# EAGLE design FET_bord (EAGLE 9.6.2)
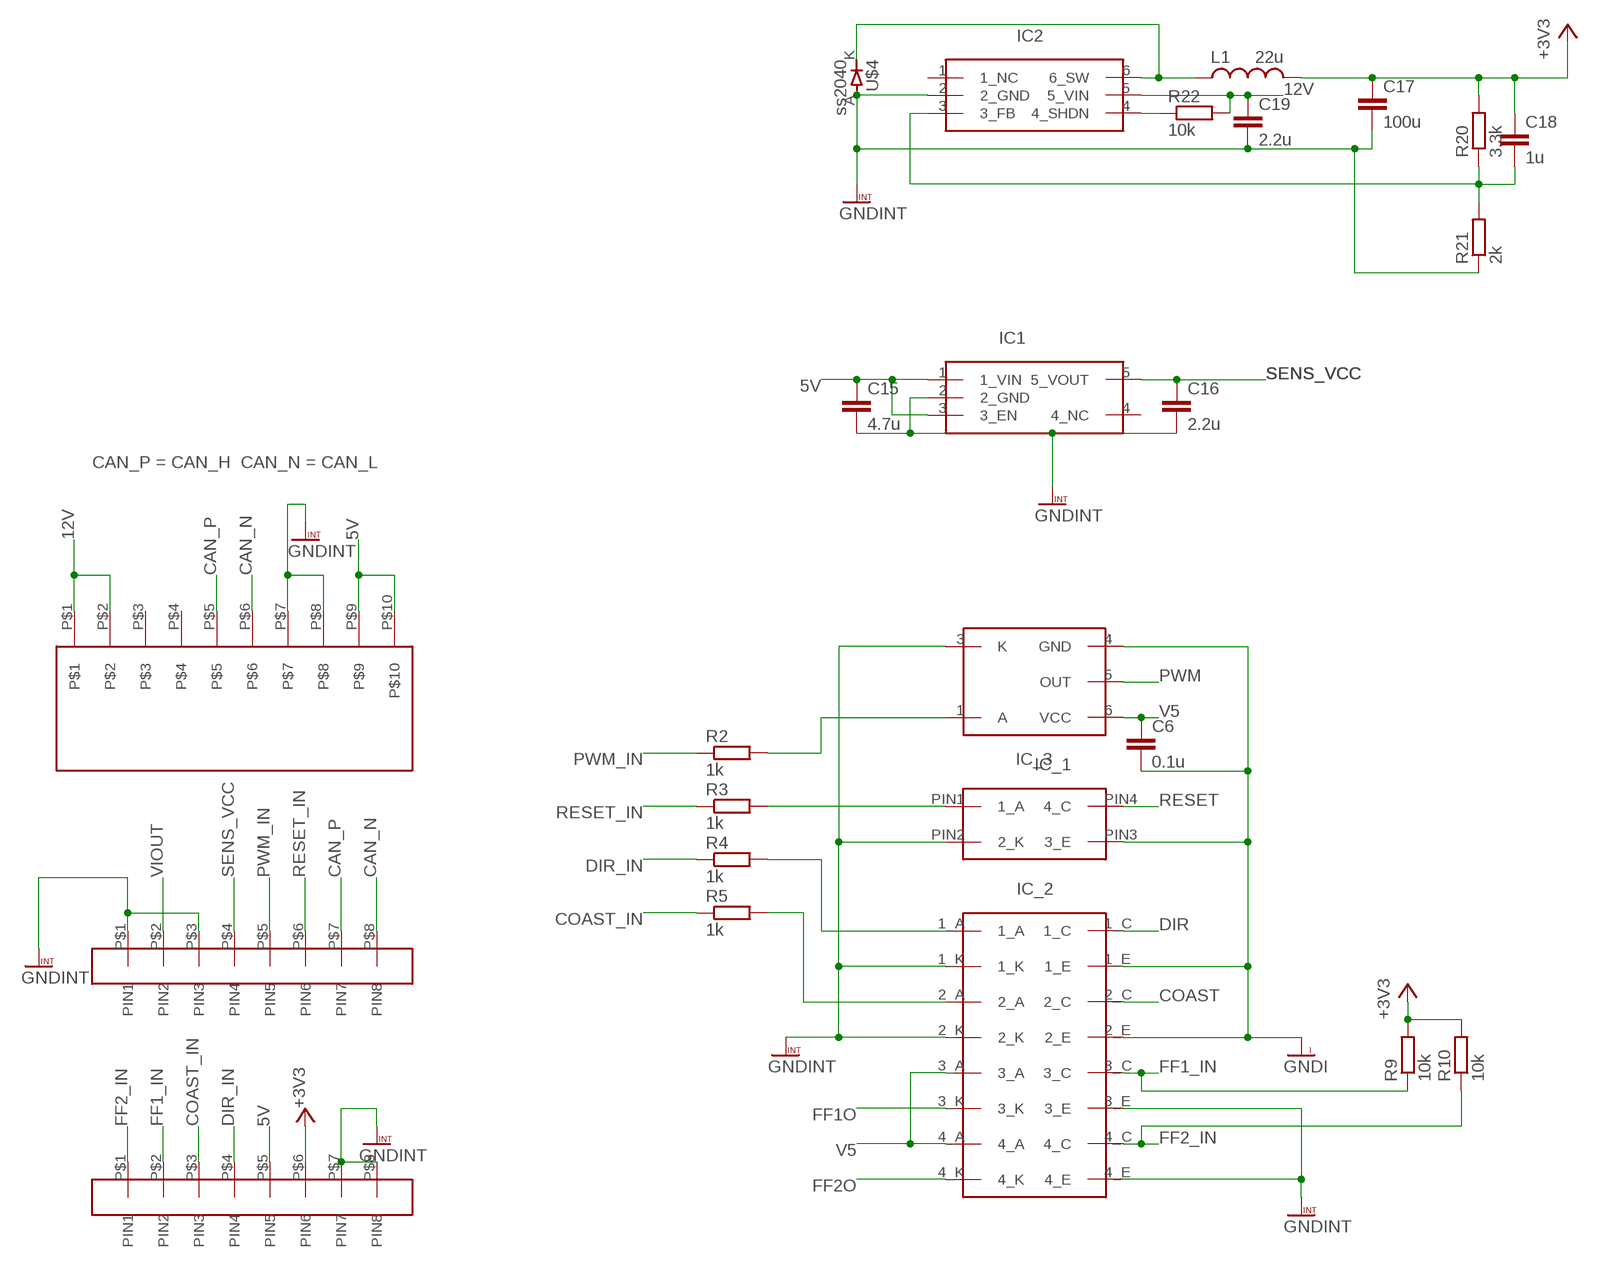
[diagram p0: schematic, sheet 1, part 1 of 2]
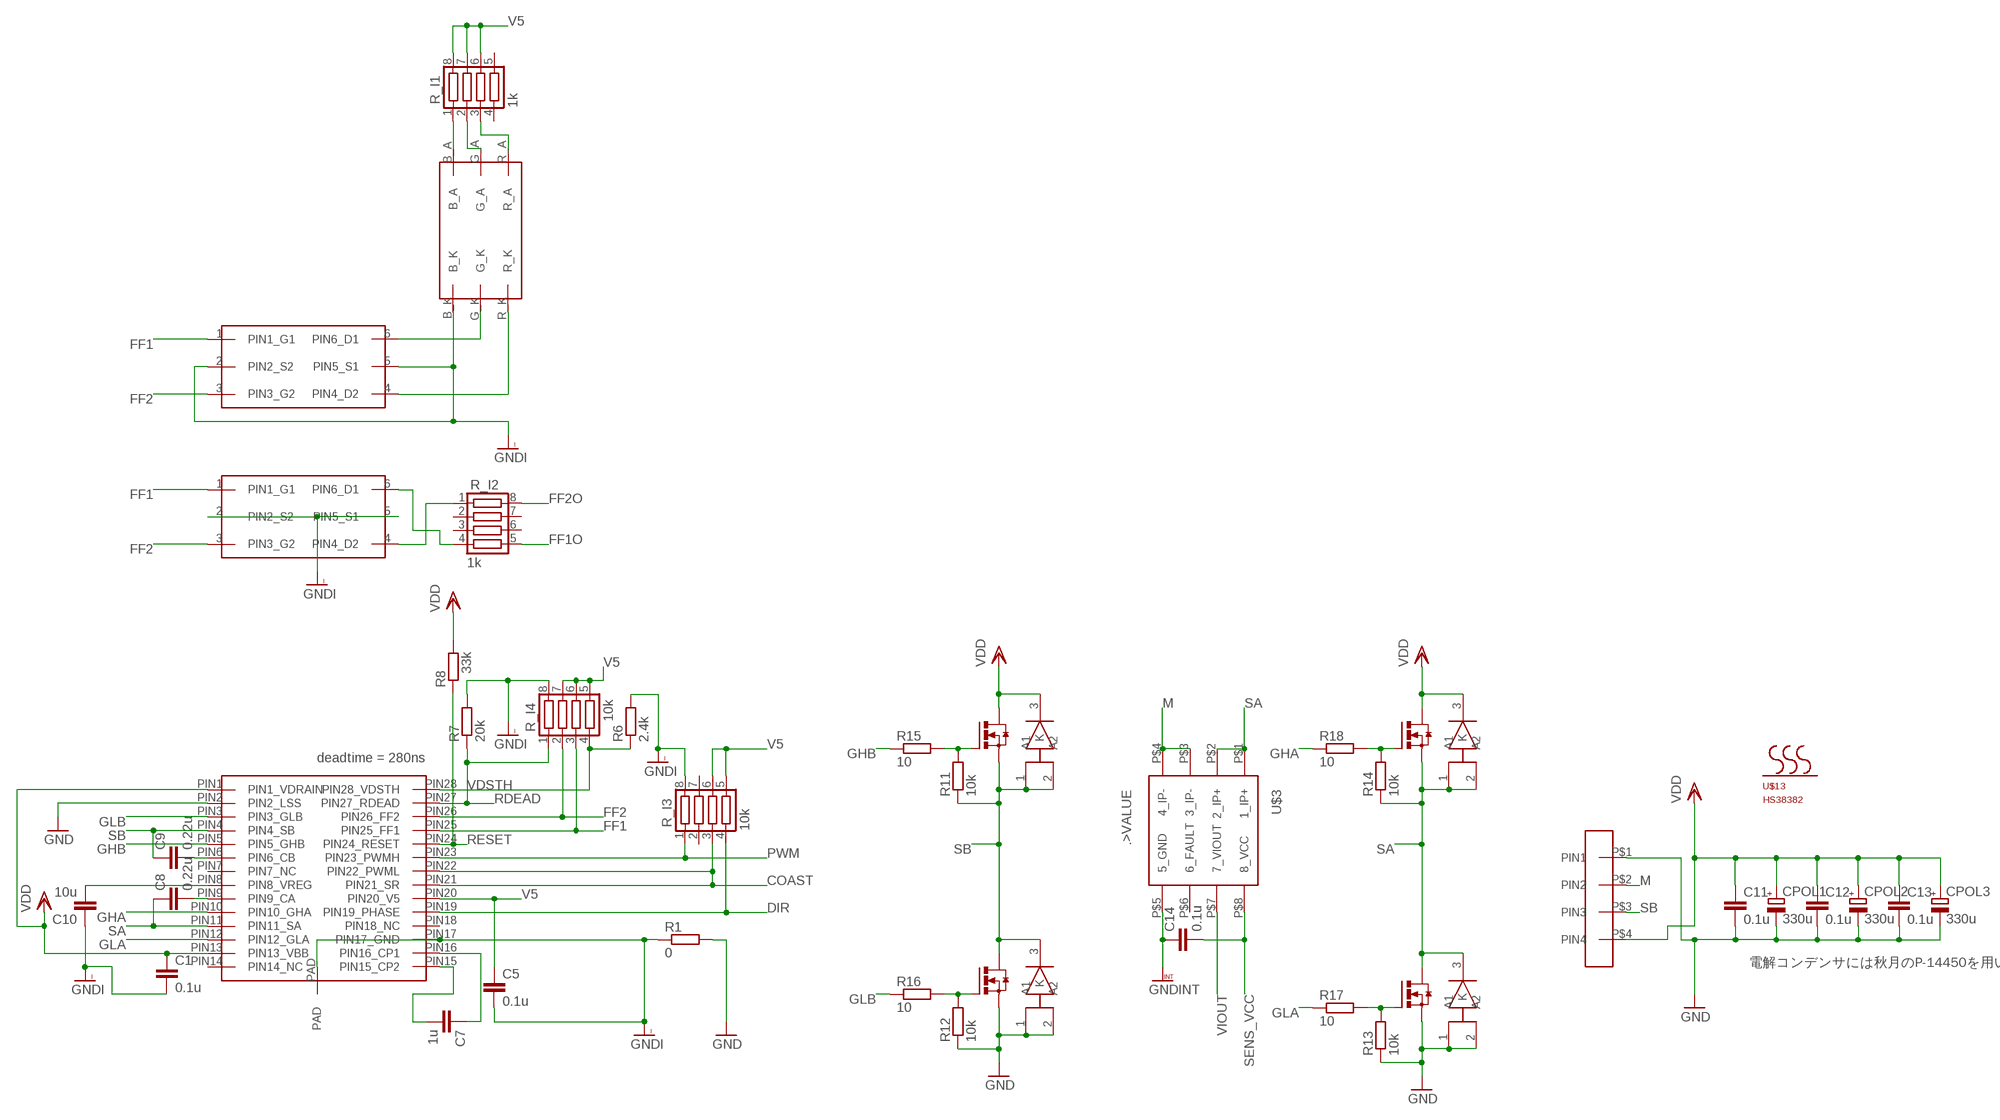
[diagram p1: schematic, sheet 1, part 2 of 2]

## Parts
C1  0.1u  C-EUC1608  [C1608]
C5  0.1u  C-EUC1608  [C1608]
C6  0.1u  C-EUC1608  [C1608]
C7  1u  C-EUC1608  [C1608]
C8  0.22u  C-EUC1608  [C1608]
C9  0.22u  C-EUC1608  [C1608]
C10  10u  C-EUC1608  [C1608]
C11  0.1u  C-EUC1608  [C1608]
C12  0.1u  C-EUC1608  [C1608]
C13  0.1u  C-EUC1608  [C1608]
C14  0.1u  C-EUC1608  [C1608]
C15  4.7u  C-EUC1608  [C1608]
C16  2.2u  C-EUC1608  [C1608]
C17  100u  C-EUC3216  [C3216]
C18  1u  C-EUC1608  [C1608]
C19  2.2u  C-EUC1608  [C1608]
CON1  JQ_P8P  [JQ_P8P]
CON2  JQ_P8P  [JQ_P8P]
CPOL1  330u  C_DEKAI  [1014CAPA]
CPOL2  330u  C_DEKAI  [1014CAPA]
CPOL3  330u  C_DEKAI  [1014CAPA]
IC1  ADP151AUJZ  [SOT23-5]
IC2  NJW1616T  [SOT23-6]
IC_1  TLP291  [TLP291]
IC_2  TLP290-4  [TLP290]
IC_3  TLP152  [SO6-5]
L1  22u  L_SMD_INDUCTOR  [SMD_INDUCTOR]
R1  0  R_REG  [1608]
R2  1k  R_REG  [1608]
R3  1k  R_REG  [1608]
R4  1k  R_REG  [1608]
R5  1k  R_REG  [1608]
R6  2.4k  R_REG  [1608]
R7  20k  R_REG  [1608]
R8  33k  R_REG  [1608]
R9  10k  R_REG  [1608]
R10  10k  R_REG  [1608]
R11  10k  R_REG  [1608]
R12  10k  R_REG  [1608]
R13  10k  R_REG  [1608]
R14  10k  R_REG  [1608]
R15  10  R_REG  [1608]
R16  10  R_REG  [1608]
R17  10  R_REG  [1608]
R18  10  R_REG  [1608]
R20  3.3k  R_REG  [1608]
R21  2k  R_REG  [1608]
R22  10k  R_REG  [1608]
R_I1  1k  R_SHUGOU  [0603X4RESISTOR]
R_I2  1k  R_SHUGOU  [0603X4RESISTOR]
R_I3  10k  R_SHUGOU2  [1005X4RESISTOR]
R_I4  10k  R_SHUGOU2  [1005X4RESISTOR]
TR1  SKI03021  [D2PACK]
TR2  SKI03021  [D2PACK]
TR3  SKI03021  [D2PACK]
TR4  SKI03021  [D2PACK]
U$1  VL_4P  [VL_4P]
U$2  A3921  [TSSOP_28P_ALLEGRO]
U$3  ACS711  [SOIC8]
U$4  ss2040  SMD_DAIOD  [SOD_123]
U$5  FDC6305  [SSOT6]
U$6  RGB_LED  [RGB_LED]
U$7  FDC6305  [SSOT6]
U$8  BOX10PBOX10P-L  [BOX10P-L]
U$9  SBR15U30SP5  [POWERDI_5]
U$10  SBR15U30SP5  [POWERDI_5]
U$11  SBR15U30SP5  [POWERDI_5]
U$12  SBR15U30SP5  [POWERDI_5]
U$13  HS38382  [38X38SQ]

## Nets
5V: C15.1 CON1.P$5(PIN5) IC1.1(1_VIN) IC1.3(3_EN) U$8.P$9 U$8.P$10
12V: C19.1 IC2.5(5_VIN) R22.2 U$8.P$1 U$8.P$2
+3V3: C17.1 C18.1 CON1.P$6(PIN6) L1.P$2 R9.2 R10.2 R20.2
CAN_N: CON2.P$8(PIN8) U$8.P$6
CAN_P: CON2.P$7(PIN7) U$8.P$5
COAST: IC_2.2_C R_I3.3 U$2.PIN21(PIN21_SR) U$2.PIN22(PIN22_PWML)
COAST_IN: CON1.P$3(PIN3) R5.1
DIR: IC_2.1_C R_I3.4 U$2.PIN19(PIN19_PHASE)
DIR_IN: CON1.P$4(PIN4) R4.1
FF1: R_I4.3 U$2.PIN25(PIN25_FF1) U$5.1(PIN1_G1) U$7.1(PIN1_G1)
FF1_IN: CON1.P$2(PIN2) IC_2.3_C R9.1
FF1O: IC_2.3_K R_I2.5
FF2: R_I4.2 U$2.PIN26(PIN26_FF2) U$5.3(PIN3_G2) U$7.3(PIN3_G2)
FF2_IN: CON1.P$1(PIN1) IC_2.4_C R10.1
FF2O: IC_2.4_K R_I2.8
GHA: R18.1 U$2.PIN10(PIN10_GHA)
GHB: R15.1 U$2.PIN5(PIN5_GHB)
GLA: R17.1 U$2.PIN12(PIN12_GLA)
GLB: R16.1 U$2.PIN3(PIN3_GLB)
GND: C11.2 C12.2 C13.2 CPOL1.- CPOL2.- CPOL3.- R1.2 R12.1 R13.1 TR3.3(PIN3_S) TR4.3(PIN3_S) U$1.P$1(PIN1) U$2.PIN2(PIN2_LSS) U$10.1(A1) U$10.2(A2) U$11.1(A1) U$11.2(A2)
GNDI: C1.2 C5.2 C6.2 C10.1 IC_1.PIN3(3_E) IC_2.1_E IC_2.2_E IC_3.4(GND) R1.1 R6.2 R7.2 R_I3.8 R_I4.8 U$2.PAD U$2.PIN17(PIN17_GND) U$5.2(PIN2_S2) U$5.5(PIN5_S1) U$6.B_K U$7.2(PIN2_S2) U$7.5(PIN5_S1)
GNDINT: C14.1 C15.2 C16.2 C17.2 C19.2 CON1.P$7(PIN7) CON1.P$8(PIN8) CON2.P$1(PIN1) CON2.P$3(PIN3) IC1.2(2_GND) IC2.2(2_GND) IC_1.PIN2(2_K) IC_2.1_K IC_2.2_K IC_2.3_E IC_2.4_E IC_3.3(K) R21.1 U$3.P$5(5_GND) U$4.A U$8.P$7 U$8.P$8
M: U$1.P$2(PIN2) U$3.P$3(3_IP-) U$3.P$4(4_IP-)
N$1: U$5.6(PIN6_D1) U$6.G_K
N$2: IC2.6(6_SW) L1.P$1 U$4.K(C)
N$3: R_I2.1 U$7.4(PIN4_D2)
N$5: U$5.4(PIN4_D2) U$6.R_K
N$6: R_I1.1 U$6.B_A
N$7: R_I1.2 U$6.G_A
N$8: R_I1.3 U$6.R_A
N$9: R_I2.4 U$7.6(PIN6_D1)
N$13: IC_3.1(A) R2.2
N$16: IC_1.PIN1(1_A) R3.2
N$17: IC_2.1_A R4.2
N$18: IC_2.2_A R5.2
N$19: C7.1 U$2.PIN16(PIN16_CP1)
N$20: C7.2 U$2.PIN15(PIN15_CP2)
N$21: C8.2 U$2.PIN9(PIN9_CA)
N$22: C9.2 U$2.PIN6(PIN6_CB)
N$23: C10.2 U$2.PIN8(PIN8_VREG)
N$24: C18.2 IC2.3(3_FB) R20.1 R21.2
N$25: R13.2 R17.2 TR4.1(PIN1_G)
N$26: R14.2 R18.2 TR2.1(PIN1_G)
N$27: R11.2 R15.2 TR1.1(PIN1_G)
N$28: R12.2 R16.2 TR3.1(PIN1_G)
N$31: IC2.4(4_SHDN) R22.1
PWM: IC_3.5(OUT) R_I3.1 U$2.PIN23(PIN23_PWMH)
PWM_IN: CON2.P$5(PIN5) R2.1
RDEAD: R7.1 R_I4.1 U$2.PIN27(PIN27_RDEAD)
RESET: IC_1.PIN4(4_C) R8.1 U$2.PIN24(PIN24_RESET)
RESET_IN: CON2.P$6(PIN6) R3.1
SA: C8.1 R14.1 TR2.3(PIN3_S) TR4.2(PIN2_D) U$2.PIN11(PIN11_SA) U$3.P$1(1_IP+) U$3.P$2(2_IP+) U$11.3(K) U$12.1(A1) U$12.2(A2)
SB: C9.1 R11.1 TR1.3(PIN3_S) TR3.2(PIN2_D) U$1.P$3(PIN3) U$2.PIN4(PIN4_SB) U$9.1(A1) U$9.2(A2) U$10.3(K)
SENS_VCC: C14.2 C16.1 CON2.P$4(PIN4) IC1.5(5_VOUT) U$3.P$8(8_VCC)
V5: C5.1 C6.1 IC_2.3_A IC_2.4_A IC_3.6(VCC) R_I1.6 R_I1.7 R_I1.8 R_I3.5 R_I3.6 R_I4.5 R_I4.6 R_I4.7 U$2.PIN20(PIN20_V5)
VDD: C1.1 C11.1 C12.1 C13.1 CPOL1.+ CPOL2.+ CPOL3.+ R8.2 TR1.2(PIN2_D) TR2.2(PIN2_D) U$1.P$4(PIN4) U$2.PIN1(PIN1_VDRAIN) U$2.PIN13(PIN13_VBB) U$9.3(K) U$12.3(K)
VDSTH: R6.1 R_I4.4 U$2.PIN28(PIN28_VDSTH)
VIOUT: CON2.P$2(PIN2) U$3.P$7(7_VIOUT)
Unconnected: IC1.4(4_NC) IC2.1(1_NC) R_I1.4 R_I1.5 R_I2.2 R_I2.3 R_I2.6 R_I2.7 R_I3.2 R_I3.7 U$2.PIN7(PIN7_NC) U$2.PIN14(PIN14_NC) U$2.PIN18(PIN18_NC) U$3.P$6(6_FAULT) U$8.P$3 U$8.P$4

## Notes on the sheet
- CAN_P = CAN_H  CAN_N = CAN_L
- deadtime = 280ns
- 電解コンデンサには秋月のP-14450を用いる

## Library data of the parts
C1 C5-C19 = rcl:C-EU: CAPACITOR, European symbol; SPICEPREFIX: C
CON1 CON2 = user_conector:JQ_P8P: jst JQコネクタ8pin ベース付きポスト 基板対基板コネクタ
CPOL1-CPOL3 = user_rcl:C_DEKAI
IC1 = user_ic:ADP151AUJZ: アナログデバイセズ 超低ノイズ3.3V出力リニアレギュレータ max current = 200 [mA] 秋月電子 通販コード : I-14180
IC2 = user_ic:NJW1616T: 新日本無線 降圧スイッチングレギュレータIC NJM1616T 秋月電子 通販コード : I-15765
IC_1 = user_ic:TLP291: フォトリフレクタ オープンドレイン インバータ出力 秋月電子で買える
IC_2 = user_ic:TLP290-4: フォトリフレクタ オープンドレイン インバータ出力
IC_3 = user_ic:TLP152: 東芝 TLP152 バッファ出力高速フォトカプラ 秋月電子 通販コード : I-10824
L1 = user_rcl:L_SMD_INDUCTOR: 秋月電子通商 NRシリーズ
R1-R18 R20-R22 = user_rcl:R_REG: チップ抵抗
R_I1-R_I4 = user_rcl:R_SHUGOU
TR1-TR4 = user_tr_fet_igbt:SKI03021: SANKEN FET SKI03021 Max Drain to Source Voltage : 30V Max Gate to Source Voltage : 20V Max Continuous Drain Current : 85A 秋月電子 通販コード : I-08473
U$1 = user_conector:VL_4P
U$2 = user_ic:A3921: ブラシ付きモーター用ゲートドライバ フルブリッジ駆動
U$3 = user_ic:ACS711: アレグロ 電流センサIC ホールセンサ式の絶縁型電流センサ 12.5A、25Aの測定レンジの種類がある digikey：620-1372-1-ND 単価：295
U$4 = user_diode:SMD_DAIOD: パッケージはSOD123
U$5 U$7 = user_tr_fet_igbt:FDC6305: デュアルNchMOSFET ゲート・ソース間絶対最大定格8v 秋月電子通商通販コード[I-06003]
U$6 = user_leds:RGB_LED: 秋月電子通商 I-12726
U$8 = user_conector:BOX10P
U$9-U$12 = user_diode:SBR15U30SP5: Diodes スーパーバリア！（デデン！）ダイオード SBR15U30SP5 逆耐圧 30V 平均順電流 15A 瞬間電流 280A 順方向電圧降下 0.49V 秋月電子 通販コード : I-07391 Trrも記載されてればいいのになぁ。多分SBRのもとのショットキー自体がそこそこはやくそれをさらに高性能にしたものだから多分はやいんじゃね
U$13 = user_heatshink:HS38382: カモン HS38382 38x38xH20 千石電商 管理コード : 7AFG-EFLZ

## Board
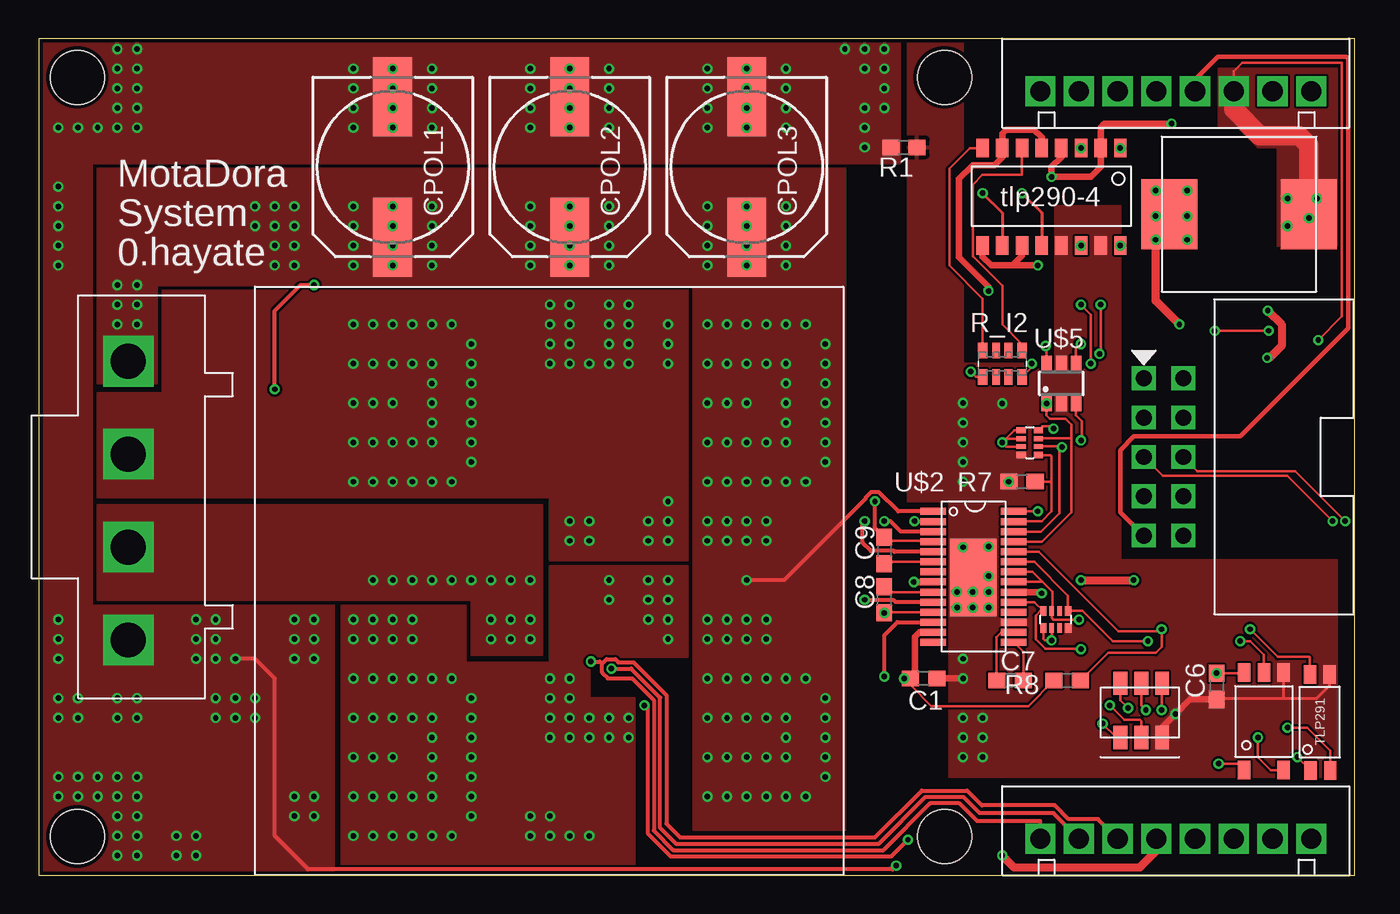
[diagram p2: board, top side]
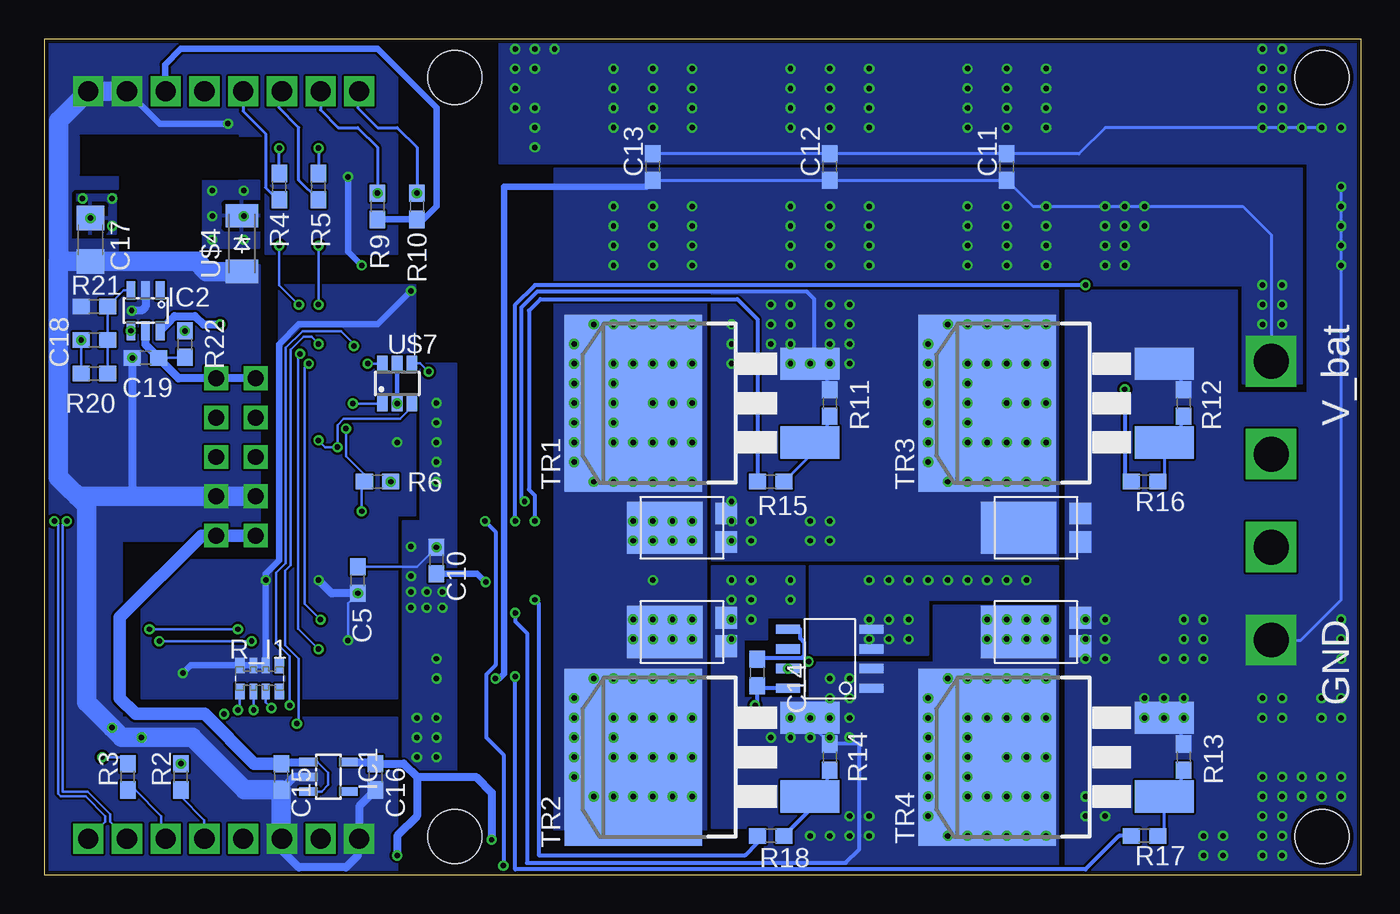
[diagram p3: board, bottom side, seen from below]

Size 85 x 54 mm. Coordinates in mm from the lower left corner, seen from the top.
Outline: 0,0 85,0 85,54 0,54 0,0
Copper layers (1*16): Top 0.035mm / dielectric 1.5mm / Bottom 0.035mm
Design rules "SeeedStudio_2layer_DRU_no_angle_20140221": minimum track width 6mil, minimum drill 12mil, track to track 6mil, track to pad 6mil, pad to pad 6mil, via to via 6mil, smd to smd 0mil, copper to edge 10mil, drill to drill 10mil, minimum pad ring 10mil, minimum via ring 6mil, stop-mask expansion 2mil, vias tented up to drill 100mil, thermal gap 10mil
Holes 3.5 mm at 2.5,51.5 2.5,2.5 58.5,2.5 58.5,51.5

### Footprints (pad centres in the part's own frame; a part is rotated, then mirrored left to right if it is on the bottom)
C1608 = smd 1.1 x 1: 1 -0.85,0; 2 0.85,0
C3216 = smd 1.6 x 1.8: 1 -1.4,0; 2 1.4,0
JQ_P8P = drill 1.3 square: P$1 2.45,2.35; P$2 4.95,2.35; P$3 7.45,2.35; P$4 9.95,2.35; P$5 12.45,2.35; P$6 14.95,2.35; P$7 17.45,2.35; P$8 19.95,2.35
1014CAPA = smd 5.079 x 2.5: + 4.531,0; - -4.531,0
SOT23-5 = smd 0.55 x 1.2: 1 -0.95,-1.3; 2 0,-1.3; 3 0.95,-1.3; 4 0.95,1.3; 5 -0.95,1.3
SOT23-6 = smd 0.55 x 1.2: 1 -0.95,-1.3; 2 0,-1.3; 3 0.95,-1.3; 4 0.95,1.3; 5 0,1.3; 6 -0.95,1.3
TLP291 = smd 1.2 x 0.8: PIN1 0.411,-0.862; PIN2 0.411,-2.132; PIN3 6.601,-2.092; PIN4 6.601,-0.822
TLP290 = smd 0.8 x 1.2: 1_A 0,-6.3; 1_C 0,0; 1_E 1.27,0; 1_K 1.27,-6.3; 2_A 2.54,-6.3; 2_C 2.54,0; 2_E 3.81,0; 2_K 3.81,-6.3; 3_A 5.08,-6.3; 3_C 5.08,0; 3_E 6.35,0; 3_K 6.35,-6.3; 4_A 7.62,-6.3; 4_C 7.62,0; 4_E 8.89,0; 4_K 8.89,-6.3
SO6-5 = smd 1.2 x 0.8: 1 -3.125,1.27; 3 -3.125,-1.27; 4 3.175,-1.27; 5 3.175,0; 6 3.175,1.27
SMD_INDUCTOR = smd 3.6 x 4.5: P$1 0,0; P$2 9,0
1608 = smd 1.1 x 1: 1 -0.85,0; 2 0.85,0
0603X4RESISTOR = smd 0.6 x 1: 1 -1.275,-0.85; 4 1.275,-0.85; 5 1.275,0.85; 8 -1.275,0.85 | smd 0.5 x 1: 2 -0.4,-0.85; 3 0.4,-0.85; 6 0.4,0.85; 7 -0.4,0.85
1005X4RESISTOR = smd 0.4 x 0.6: 1 0.2,-0.8; 4 1.8,-0.8; 5 1.8,0.3; 8 0.2,0.3 | smd 0.3 x 0.6: 2 0.75,-0.8; 3 1.25,-0.8; 6 1.25,0.3; 7 0.75,0.3
D2PACK = smd 2.083 x 3.81: 1 -2.54,-8.89; 3 2.54,-8.89 | smd 11.43 x 8.89: 2 0,2.54
VL_4P = drill 2.25 square: P$1 3.75,-3.25; P$2 9.75,-3.25; P$3 15.75,-3.25; P$4 21.75,-3.25
TSSOP_28P_ALLEGRO = smd 5 x 3: PAD 4.906,1.942 | smd 0.45 x 1.65: PIN1 0.65,-0.65; PIN2 1.3,-0.65; PIN3 1.95,-0.65; PIN4 2.6,-0.65; PIN5 3.25,-0.65; PIN6 3.9,-0.65; PIN7 4.55,-0.65; PIN8 5.2,-0.65; PIN9 5.85,-0.65; PIN10 6.5,-0.65; PIN11 7.15,-0.65; PIN12 7.8,-0.65; PIN13 8.45,-0.65; PIN14 9.1,-0.65; PIN15 9.1,4.55; PIN16 8.45,4.55; PIN17 7.8,4.55; PIN18 7.15,4.55; PIN19 6.5,4.55; PIN20 5.85,4.55; PIN21 5.2,4.55; PIN22 4.55,4.55; PIN23 3.9,4.55; PIN24 3.25,4.55; PIN25 2.6,4.55; PIN26 1.95,4.55; PIN27 1.3,4.55; PIN28 0.65,4.55
SOIC8 = smd 1.55 x 0.6: P$1 -2.7,1.905; P$2 -2.7,0.635; P$3 -2.7,-0.635; P$4 -2.7,-1.905; P$5 2.7,-1.905; P$6 2.7,-0.635; P$7 2.7,0.635; P$8 2.7,1.905
SOD_123 = smd 1.5 x 2.1: A 1.8,0; K -1.8,0
SSOT6 = smd 0.69 x 0.99: 1 -0.95,-1.3; 2 0,-1.3; 3 0.95,-1.3; 4 0.95,1.3; 5 0,1.3; 6 -0.95,1.3
RGB_LED = smd 1.5 x 0.9: B_A 3.5,-2.7; B_K 0,-2.7; G_A 3.5,-1.35; G_K 0,-1.35; R_A 3.5,0; R_K 0,0
BOX10P-L = drill 1.02 square: P$1 5.08,2.54; P$2 5.08,0; P$3 2.54,2.54; P$4 2.54,0; P$5 0,2.54; P$6 0,0; P$7 -2.54,2.54; P$8 -2.54,0; P$9 -5.08,2.54; P$10 -5.08,0
POWERDI_5 = smd 1.39 x 1.4: 1 1.063,-0.177; 2 2.903,-0.177 | smd 3.36 x 4.86: 3 1.983,3.805

### Placement (x,y rotation side)
C1  57.15,12.7 0 top
C5  64.77,19.05 90 bottom
C6  76.07,12.19 270 top
C7  62.74,12.57 0 top
C8  54.61,17.78 90 top
C9  54.61,20.95 270 top
C10  59.69,20.32 270 bottom
C11  22.86,45.72 90 bottom
C12  34.29,45.72 90 bottom
C13  45.72,45.72 90 bottom
C14  38.99,13.08 270 bottom
C15  69.72,6.35 270 bottom
C16  63.63,6.35 270 bottom
C17  82.04,41.02 270 bottom
C18  81.79,34.54 0 bottom
C19  78.49,33.4 180 bottom
CON1  62.23,48.26 0 top
CON2  62.23,0 0 top
CPOL1  22.86,45.72 270 top
CPOL2  34.29,45.72 270 top
CPOL3  45.72,45.72 270 top
IC1  66.67,6.35 270 bottom
IC2  78.49,36.45 180 bottom
IC_1  81.28,6.35 90 top
IC_2  69.85,40.64 180 top
IC_3  79.12,9.91 90 top
L1  73.03,42.67 0 top
R1  55.88,46.99 180 top
R2  76.2,6.35 90 bottom
R3  79.63,6.35 90 bottom
R4  69.85,44.45 90 bottom
R5  67.31,44.45 90 bottom
R6  63.5,25.4 0 bottom
R7  63.5,25.4 180 top
R8  66.42,12.57 180 top
R9  63.5,43.18 270 bottom
R10  60.96,43.18 270 bottom
R11  34.29,30.48 270 bottom
R12  11.43,30.48 270 bottom
R13  11.43,7.62 270 bottom
R14  34.29,7.62 270 bottom
R15  38.1,25.4 0 bottom
R16  13.97,25.4 0 bottom
R17  13.97,2.54 0 bottom
R18  38.1,2.54 0 bottom
R20  81.79,32.38 180 bottom
R21  81.79,36.7 0 bottom
R22  75.95,34.29 270 bottom
R_I1  71.12,12.7 0 bottom
R_I2  62.23,33.02 0 top
R_I3  66.67,16.26 180 top
R_I4  63.75,26.92 90 top
TR1  44.45,30.48 90 bottom
TR2  44.45,7.62 90 bottom
TR3  21.59,30.48 90 bottom
TR4  21.59,7.62 90 bottom
U$1  2.54,11.43 90 top
U$2  58.42,24.13 270 top
U$3  34.29,13.97 180 bottom
U$4  72.26,40.77 270 bottom
U$5  66.04,31.75 0 top
U$6  69.85,8.89 90 top
U$7  62.23,31.75 0 bottom
U$8  73.91,27 90 top
U$9  41.15,20.45 90 bottom
U$10  18.29,20.45 90 bottom
U$11  18.29,13.72 90 bottom
U$12  41.15,13.72 90 bottom
U$13  13.97,0 0 top

### Tracks (layer width: path | path; a pad name or v marks a point on that pad's centre or on a via)
5V
  Top 0.305: U$8.P$9 69.85,23.44 69.85,27.44 70.73,28.32 77.6,28.32 84.58,35.31 84.58,52.7 84.45,52.83 76.14,52.83 74.68,51.37 CON1.P$5
  Bottom 0.152: IC1.3 67.12,5.4 66.67,5.84 66.67,6.6 67.37,7.3 IC1.1 | C15.1 69.63,7.2 69.53,7.3
  Bottom 0.508: 69.53,7.3 IC1.1
  Bottom 0.813: C15.1 71.46,7.2 74.68,10.41 79.12,10.41 80.14,11.43 80.14,16.64 74.85,21.92 U$8.P$10 U$8.P$9
12V
  Bottom 0.152: R22.2 75.98,33.4 C19.1
  Bottom 0.508: U$8.P$1 U$8.P$2 76.35,32.08 77.64,33.36 C19.1 78.49,34.25 IC2.5
+3V3  (via drill 0.35)
  Top 0.152: 82.03,43.94 L1.P$2 82.04,42.66 C17.1 | C18.1 84.16,36.07 84.16,52.45 77.72,52.45 77.18,51.91 CON1.P$6
  Top 1.27: 82.03,43.94 82.03,47.13 81.41,47.75 78.87,47.75 77.18,49.44 CON1.P$6
  Bottom 0.152: C17.1 | C18.1 R20.2
  Bottom 0.406: R9.2 R10.2 60.54,42.33 59.69,43.18 59.69,49.53 63.5,53.34 76.2,53.34 77.22,52.32 77.22,50.65 CON1.P$6
  other vias: 80.64,43.69 82.55,43.69 80.64,41.91 82.04,42.42 82.64,34.54
  pour Bottom: 80.39,43.94 82.93,43.94 82.93,41.66 82.68,41.4 80.39,41.4
  pour Top (no thermals): 76.2,48.26 76.2,52.07 83.82,52.07 83.82,40.64 80.01,40.64 80.01,46.99 78.74,46.99 77.47,48.26
CAN_N  (via drill 0.35)
  Top 0.152: v84.38,22.86 81.15,26.09 74.83,26.09 U$8.P$6
  Bottom 0.152: CON2.P$8 81.08,3.45 81.08,3.81 82.35,5.08 83.95,5.08 84.12,5.26 84.12,10.16 84.12,22.61 v84.38,22.86
CAN_P  (via drill 0.35)
  Top 0.152: v83.57,22.86 80.65,25.78 72.59,25.78 U$8.P$5
  Bottom 0.152: CON2.P$7 80.78,3.45 80.78,3.94 82.23,5.38 83.82,5.38 83.82,22.61 v83.57,22.86
COAST  (via drill 0.35)
  Top 0.152: 64.83,18.93 U$2.PIN21 | U$2.PIN22 64.18,19.58 64.83,18.93 | 64.83,18.93 65.45,18.3 65.45,17.08 R_I3.3 65.42,16.62 65.54,16.5 v67.18,16.5 | v67.94,33.02 67.94,36.2 v67.31,36.83
  Bottom 0.152: v67.18,16.5 68.2,17.52 68.2,32.77 v67.94,33.02 | v67.31,36.83 IC_2.2_C
  other vias: 67.31,40.64
COAST_IN
  Bottom 0.203: R5.1 68.58,44.87 68.58,48.26 69.85,49.53 69.85,50.44 CON1.P$3
DIR  (via drill 0.35)
  Top 0.152: U$2.PIN19 64.3,17.63 R_I3.4 64.68,17.06 64.39,16.76 64.39,15.24 65.02,14.61 v67.3,14.61 v67.31,14.6 | v68.58,36.83 68.58,33.73 v68.5,33.66
  Bottom 0.152: v68.5,33.66 68.63,33.53 68.63,15.91 v67.31,14.6 | IC_2.1_C 69.85,38.1 v68.58,36.83
  other vias: 69.85,40.64
DIR_IN
  Bottom 0.203: CON1.P$4 72.18,49.32 70.73,47.87 70.73,44.39 69.94,43.6 R4.1
FF1  (via drill 0.35)
  Top 0.152: U$2.PIN25 64.77,21.53 66.67,23.43 66.67,28.19 | 66.67,28.19 64.57,28.19 R_I4.3 | U$5.1 65.09,29.69 65.31,29.46 66.29,29.46 66.67,29.08 66.67,28.19
  Bottom 0.152: U$7.1 U$5.1
  other vias: 65.09,30.45
FF1_IN  (via drill 0.35)
  Top 0.203: R9.1 64.77,42.76 IC_2.3_C
  Bottom 0.203: CON1.P$2 67.18,49.4 66.04,48.26 64.77,48.26 63.5,46.99 R9.1
  other vias: 63.5,44.03
FF1O
  Top 0.152: R_I2.5 63.51,34.28 62.23,35.56 62.23,38.05 60.33,39.95 60.33,44.58 60.96,45.21 63.5,45.21 IC_2.3_K
FF2  (via drill 0.35)
  Top 0.152: U$2.PIN26 64.72,22.18 65.91,23.37 65.91,27.69 | 65.91,27.69 64.57,27.69 R_I4.2 | 65.91,27.69 66.04,27.69 v66.09,27.64 | U$5.3 66.99,29.69 67.37,29.31 67.37,28.13 v67.31,28.07
  Bottom 0.152: U$7.3 61.28,30.24 62.05,29.46 65.68,29.46 66.09,29.06 v66.09,27.64 66.88,27.64 v67.31,28.07
FF2_IN  (via drill 0.35)
  Top 0.203: R10.1 62.23,42.76 IC_2.4_C
  Bottom 0.203: CON1.P$1 64.77,50.52 64.77,49.53 63.5,48.26 62.23,48.26 60.96,46.99 R10.1
  other vias: 60.96,44.03
FF2O
  Top 0.152: R_I2.8 60.95,37.22 58.8,39.37 58.8,45.59 60.15,46.94 IC_2.4_K
GHA  (via drill 0.35)
  Top 0.254: U$2.PIN10 55.35,17.63 55.23,17.76 53.36,17.76 v53.34,17.78
  Bottom 0.254: v53.34,17.78 53.09,17.53 53.09,1.29 39.75,1.29 38.95,2.1 R18.1
GHB  (via drill 0.35)
  Top 0.254: U$2.PIN5 55.28,20.88 55.23,20.93 53.74,20.93 53.21,21.46 53.21,22.73 v53.34,22.86
  Bottom 0.254: v53.34,22.86 53.34,24.51 53.72,24.89 53.72,36.45 52.98,37.19 40.26,37.19 38.95,35.88 R15.1
GLA  (via drill 0.35)
  Top 0.254: U$2.PIN12 55.45,16.33 54.61,15.48 v54.61,12.83
  Bottom 0.254: R17.1 15.62,2.54 17.78,0.38 54.61,0.38 v54.61,12.83
GLB  (via drill 0.35)
  Top 0.254: U$2.PIN3 55.68,22.18 55,22.86 v54.61,22.86 | v17.78,38.1 16.89,38.1 15.24,36.45 v15.24,31.37
  Bottom 0.254: v54.61,22.86 54.61,36.83 53.34,38.1 v17.78,38.1 | v15.24,31.37 15.24,25.82 R16.1
GND  (via drill 0.35)
  Top 0.254: U$2.PIN2 56.59,22.83 v56.56,22.86 | v55.37,0.61 55.14,0.38 17.4,0.38 15.24,2.54 15.24,12.7 13.97,13.97 v12.7,13.97
  Bottom 0.203: U$1.P$1 3.87,15.18 1.27,17.78 v1.27,39.37 v1.27,40.64 v1.27,41.91 v1.27,43.18 v1.27,44.45 | v2.54,48.26 v3.81,48.26 v5.08,48.26 v6.35,48.26 7.62,48.26 8.89,48.26 16.51,48.26 18.2,46.57 C11.2 C12.2 C13.2 | R13.1 11.43,8.89 TR4.3 | R12.1 11.43,31.75 TR3.3
  Bottom 0.254: v56.56,22.86 55.88,22.18 55.88,13.56 56.49,12.95 56.49,8.89 55.37,7.78 v55.37,0.61
  other vias: 5.08,53.34 6.35,53.34 6.35,52.07 5.08,52.07 6.35,50.8 6.35,49.53 5.08,49.53 5.08,50.8 1.27,48.26 1.27,16.51 1.27,15.24 1.27,13.97 1.27,11.43 2.54,11.43 5.08,11.43 6.35,11.43 10.16,13.97 10.16,15.24 10.16,16.51 6.35,10.16 5.08,10.16 2.54,10.16 1.27,10.16 8.89,1.27 8.89,2.54 6.35,6.35 6.35,5.08 6.35,3.81 6.35,2.54 6.35,1.27 5.08,1.27 5.08,2.54 5.08,3.81 5.08,5.08 5.08,6.35 3.81,5.08 2.54,5.08 1.27,5.08 1.27,6.35 2.54,6.35 3.81,6.35 16.51,3.81 17.78,3.81 17.78,5.08 16.51,5.08 17.78,13.97 17.78,15.24 17.78,16.51 16.51,16.51 16.51,15.24 16.51,13.97 20.32,48.26 20.32,49.53 20.32,50.8 20.32,52.07 22.86,52.07 22.86,50.8 22.86,49.53 22.86,48.26 25.4,48.26 25.4,49.53 25.4,50.8 25.4,52.07 31.75,48.26 31.75,49.53 31.75,50.8 31.75,52.07 34.29,52.07 34.29,50.8 34.29,49.53 34.29,48.26 36.83,48.26 36.83,49.53 36.83,50.8 36.83,52.07 43.18,52.07 43.18,50.8 43.18,49.53 43.18,48.26 45.72,48.26 45.72,49.53 45.72,50.8 45.72,52.07 48.26,52.07 48.26,50.8 48.26,49.53 48.26,48.26 53.34,46.99 53.34,48.26 53.34,49.53 54.61,49.53 53.34,52.07 54.61,52.07 54.61,53.34 53.34,53.34 12.7,10.16 54.61,50.8 52.07,53.34 11.43,13.97 11.43,15.24 11.43,16.51 11.43,11.43 12.7,11.43 13.97,11.43 13.97,10.16 11.43,10.16 10.16,2.54 10.16,1.27
  pour Top (no thermals): 55.63,54.61 55.63,45.97 0,45.97 0,54.61
  pour Bottom (no thermals): 0,54.61 55.63,54.61 55.63,45.97 0,45.97
  pour Bottom (no thermals): 0,48.13 0,0 19.05,0 19.05,37.72 8,37.72 8,31.11 3.43,31.11 3.43,48.13
  pour Top (no thermals): 0,48.26 0,0 19.05,0 19.05,17.4 3.43,17.4 3.43,48.26
GNDI  (via drill 0.35)
  Top 0.203: C6.2 76.16,11.43 80.39,11.43 | IC_1.PIN3 83.37,12.25 82.55,11.43 80.39,11.43 | IC_3.4 80.39,11.43
  Top 0.406: U$6.B_K 72.55,9.54 v73.41,10.41 74.35,11.34 C6.2 | C10.1 60.36,20.5 U$2.PAD | v59.69,12.7 C1.2
  Bottom 0.152: C5.2 60.96,19.9 C10.1
  Bottom 0.305: U$7.5 U$7.2
  other vias: 62.65,25.4 59.69,21.17 59.69,7.62 60.96,7.62 60.96,8.89 59.69,8.89 59.69,10.16 60.96,10.16 59.69,13.97 59.31,17.27 60.33,17.27 61.34,17.27 59.31,18.29 60.33,18.29 61.34,18.29 61.34,19.3 61.34,21.21 59.69,25.4 59.69,26.67 59.69,27.94 59.69,29.21 59.69,30.48 62.23,30.45
  pour Top (no thermals): 83.82,6.35 83.82,20.32 69.85,20.32 69.85,43.18 65.66,43.18 65.66,33.02 58.8,33.02 58.8,6.35
  pour Bottom (no thermals): 58.42,33.02 58.42,6.35 61.72,6.35 61.85,6.22 61.85,22.86 60.71,22.86 60.71,33.02
  pour Top: 56.13,54.61 56.13,24.13 59.69,24.13 59.69,54.61
GNDINT  (via drill 0.35)
  Top 0.152: IC_3.3 79.58,6.78 78.74,7.62 v78.74,8.89 | IC_1.PIN2 83.41,8.03 81.92,9.53 v80.64,9.53
  Top 0.254: CON2.P$1 64.68,3.49 60.62,3.49 59.47,4.64 57.57,4.64 54.56,1.63 40.98,1.63 39.73,2.88 39.73,11.29 38.32,12.7 36.77,12.7 36.38,13.08 36.38,13.65 | CON2.P$3 68.41,3.62 66.5,3.62 65.62,4.51 60.92,4.51 59.97,5.46 57.02,5.46 54,2.44 41.43,2.44 40.54,3.33 40.54,11.63 38.43,13.74 37.44,13.74 37.24,13.94 36.67,13.94 36.38,13.65 | v35.67,13.79 36.24,13.79 36.38,13.65
  Top 0.406: IC_2.4_E 60.96,39.93 61.52,39.37 62.87,39.37 | 62.87,39.37 63.5,40.01 IC_2.3_E | 62.87,39.37 v64.52,39.37 | IC_2.2_K 66.04,46.35 65.41,45.72 v65.41,45.09 67.94,45.09 68.58,45.72 IC_2.1_K 68.58,48.26 68.83,48.51 v73.15,48.51
  Top 0.508: v79.38,36.45 80.26,35.56 80.26,34.16 79.5,33.4 C19.2
  Bottom 0.254: U$3.P$5 36.2,15.88 36.2,15.28 35.94,15.02 35.94,14.19 36.1,14.03 | C14.1 38.89,14.03 36.1,14.03 | 36.1,14.03 35.9,14.03 v35.67,13.79
  Bottom 0.406: v64.52,39.37 65.41,40.26 v65.41,45.09 | v73.15,48.51 77.58,48.51 CON1.P$7
  Bottom 0.508: 72.37,38.86 U$4.A | IC1.2 68.87,6.35 C15.2 | C16.2 64.68,4.45 CON2.P$1 64.77,2.26 64.77,1.27 65.53,0.51 68.58,0.51 69.72,1.65 69.72,2.39 | IC2.2 78.49,36.7 78.74,36.45 v79.38,36.45 | C19.2 79.34,24.46 U$8.P$8
  Bottom 1.27: CON1.P$7 CON1.P$8 84.07,48.72 84.07,39.62 C17.2 | 84.1,33.3 84.11,33.31 | 84.11,33.31 84.11,39.62 C17.2 | CON2.P$3 69.72,2.39 C15.2 72.07,5.5 75.46,8.89 v78.74,8.89 80.01,8.89 v80.64,9.53 82.3,11.18 82.3,23.88 84.11,25.69 84.11,33.31 | U$8.P$7 U$8.P$8 82.88,24.46 | U$4.A 74.53,38.97 75.18,39.62 C17.2
  other vias: 79.34,33.4
  cutout Bottom: 72.52,47.75 82.68,47.75 82.68,45.21 80.14,45.21 80.14,40.13 80.77,40.13 80.77,39.62 73.79,39.62 73.79,40.39 74.93,40.39 74.93,44.96 72.52,44.96
  cutout Top: 72.52,47.75 77.47,47.75 78.74,46.48 79.63,46.48 79.63,40.13 80.77,40.13 80.77,38.61 73.41,38.61 73.41,40.26 75.06,40.26 75.06,45.09 74.93,45.21 72.52,45.21
  pour Bottom (no thermals): 62.23,54.61 85.09,54.61 85.09,0 62.23,0 62.23,10.16 80.01,10.16 80.01,21.59 71.12,21.59 71.12,39.37 80.14,39.37 80.14,41.02 83.31,41.02 83.31,44.07 83.06,44.32 80.26,44.32 80.26,47.62 80.14,47.75 70.74,47.75 70.74,40.13 62.23,40.13
M  (via drill 0.35)
  other vias: 21.59,19.05 22.86,19.05 24.13,19.05 25.4,19.05 26.67,19.05 27.94,19.05 29.21,19.05 30.48,19.05 31.75,19.05 31.75,15.24 30.48,15.24 30.48,16.51 31.75,16.51 29.21,15.24 29.21,16.51
  pour Top (no thermals): 3.81,17.78 27.94,17.78 27.94,14.22 32.51,14.22 32.51,23.88 3.81,23.88
  pour Bottom (no thermals): 27.94,14.22 32.51,14.22 32.51,19.94 19.56,19.94 19.56,17.78 27.94,17.78
  pour Bottom: 31.75,14.22 35.56,14.22 35.56,19.94 31.75,19.94
N$1  (via drill 0.35)
  Top 0.152: U$6.G_K 71.2,9.95 71.12,10.03 70.1,10.03 v69.17,10.97 | v65.02,34.16 65.09,34.1 U$5.6
  Bottom 0.152: v65.02,34.16 65.02,34.29 65.86,35.13 68.33,35.13 69.42,34.04 69.42,20.14 70.04,19.52 70.04,15 69.17,14.13 v69.17,10.97
N$2  (via drill 0.35)
  Top 0.508: v72.14,41.02 72.14,37.08 v73.66,35.56 | L1.P$1 72.9,42.55 v72.14,42.55
  Bottom 0.508: v73.66,35.56 74.74,35.56 75.28,36.1 76.61,36.1 76.85,35.86 76.85,35.83 IC2.6
  other vias: 72.14,44.2 74.17,44.2 74.17,42.55 74.17,41.02
  pour Bottom: 71.12,44.83 74.8,44.83 74.8,40.51 71.12,40.51
N$3  (via drill 0.35)
  Top 0.152: v60.2,32.51 60.54,32.17 R_I2.1
  Bottom 0.152: U$7.4 60.74,33.05 v60.2,32.51
N$5  (via drill 0.35)
  Top 0.152: U$5.4 66.99,33.97 v67.31,34.29 | v68.71,9.78 69.6,8.89 U$6.R_K
  Bottom 0.152: v67.31,34.29 67.77,34.75 68.28,34.75 69.11,33.91 69.11,20.02 69.47,19.66 69.47,14.86 68.58,13.97 68.58,9.91 v68.71,9.78
N$6  (via drill 0.35)
  Top 0.152: v72.52,10.67 72.52,12.36 U$6.B_A
  Bottom 0.152: R_I1.1 72.39,10.79 v72.52,10.67
N$7  (via drill 0.35)
  Top 0.152: U$6.G_A 71.2,10.97 v71.5,10.67
  Bottom 0.152: v71.5,10.67 71.5,11.83 R_I1.2
N$8  (via drill 0.35)
  Top 0.152: v70.36,10.79 69.85,11.3 U$6.R_A
  Bottom 0.152: R_I1.3 70.72,11.16 v70.36,10.79
N$9  (via drill 0.35)
  Top 0.152: R_I2.4 64.14,32.8 v64.14,33.02
  Bottom 0.152: v64.14,33.02 63.21,33.02 U$7.6
N$13  (via drill 0.35)
  Top 0.152: R2.2 77.43,7.2 IC_3.1
  other vias: 76.2,7.2
N$16  (via drill 0.35)
  Top 0.152: v81.28,7.62 IC_1.PIN1
  Bottom 0.152: R3.2 80.05,7.62 v81.28,7.62
N$17  (via drill 0.35)
  Bottom 0.203: R4.2 IC_2.1_A
  other vias: 69.85,46.94
N$18  (via drill 0.35)
  Bottom 0.203: IC_2.2_A R5.2
  other vias: 67.31,46.94
N$19
  Top 0.152: C7.1 61.85,12.61 61.85,15.37 62.16,15.68 U$2.PIN16
N$20
  Top 0.152: U$2.PIN15 63.59,14.41 C7.2
N$21
  Top 0.152: C8.2 54.96,18.28 U$2.PIN9
N$22
  Top 0.152: U$2.PIN6 54.73,20.23 C9.2
N$23  (via drill 0.35)
  Top 0.406: U$2.PIN8 v56.52,18.92
  Bottom 0.406: v56.52,18.92 57.06,19.47 C10.2
N$24
  Bottom 0.152: R20.1 C18.2 R21.2 79.89,37.75 IC2.3
N$25
  Bottom 0.203: R17.2 12.7,2.96 TR4.1 11.43,6.35 R13.2
N$26
  Bottom 0.203: R14.2 34.29,6.35 TR2.1
  Bottom 0.254: R18.2 35.56,4.23 TR2.1
N$27
  Bottom 0.203: R15.2 35.56,27.09 TR1.1 34.29,29.21 R11.2
N$28
  Bottom 0.203: R16.2 12.7,25.82 TR3.1 11.43,29.21 R12.2
N$31  (via drill 0.35)
  Top 0.152: IC2.4 79.43,35.14 R22.1
  other vias: 75.95,35.14 79.44,35.15
PWM  (via drill 0.35)
  Top 0.152: U$2.PIN23 64.29,20.23 66.47,18.04 R_I3.1 67.41,17.06 69.36,15.11 v71.63,15.11 | v77.6,15.11 78.23,15.11 79.12,14.22 IC_3.5
  Bottom 0.152: v77.6,15.11 v71.63,15.11
PWM_IN
  Bottom 0.152: CON2.P$5 74.68,3.56 76.2,5.08 R2.1
RDEAD
  Top 0.152: U$2.PIN27 63,22.86 64.77,22.86 65.41,23.5 65.41,25.4 | 65.41,25.4 65.41,27.05 65.33,27.12 R_I4.1 | R7.1 65.41,25.4
RESET  (via drill 0.35)
  Top 0.152: U$2.PIN24 64.59,20.88 69.72,15.75 72.39,15.75 v72.52,15.88 72.52,14.73 72.14,14.35 69.09,14.35 67.31,12.57 R8.1 | IC_1.PIN4 82.1,14.04 82.04,14.1 80.01,14.1 v78.23,15.88
  Bottom 0.152: v72.52,15.88 v78.23,15.88
RESET_IN
  Bottom 0.152: CON2.P$6 77.47,2.64 77.47,3.81 79.16,5.5 R3.1
SA  (via drill 0.35)
  Top 0.152: U$2.PIN11 54.66,16.98 C8.1
  Bottom 0.203: R14.1 35.56,9.74 TR2.3
  Bottom 0.254: C8.1 54.61,16.38 53.85,15.62 53.85,0.79 33.27,0.79 32.38,1.68 32.38,8.47 R14.1
  other vias: 54.61,16.93 20.32,12.7 21.59,12.7 22.86,12.7 24.13,12.7 25.4,12.7 26.67,12.7 27.94,11.43 27.94,10.16 27.94,8.89 27.94,7.62 27.94,6.35 27.94,5.08 27.94,3.81 26.67,2.54 25.4,2.54 24.13,2.54 22.86,2.54 21.59,2.54 20.32,2.54 20.32,5.08 21.59,5.08 22.86,5.08 24.13,5.08 25.4,5.08 25.4,6.35 25.4,7.62 25.4,8.89 25.4,10.16 24.13,10.16 22.86,10.16 21.59,10.16 20.32,10.16 39.37,19.05 40.64,19.05 39.37,17.78 40.64,17.78 39.37,16.51 40.64,16.51 40.64,15.24 20.32,16.51 21.59,16.51 22.86,16.51 24.13,16.51 20.32,15.24 21.59,15.24 22.86,15.24 24.13,15.24 33.02,2.54 33.02,3.81 33.02,10.16 33.02,11.43 33.02,12.7 36.83,19.05 36.83,17.78 35.56,10.16 31.75,3.81 31.75,2.54 34.29,2.54 35.56,2.54 33.02,8.89 34.29,8.89 35.56,8.89 36.83,8.89 38.1,8.89 38.1,10.16 36.83,10.16 34.29,10.16 34.29,11.43 34.29,12.7 22.86,7.62 21.59,7.62 20.32,7.62
  pour Bottom (no thermals): 19.56,17.4 19.56,0 38.48,0 38.48,3.05 41.91,3.05 41.91,11.43 35.56,11.43 35.56,13.72 27.56,13.72 27.56,17.4
  pour Bottom (no thermals): 35.94,19.94 41.91,19.94 41.91,10.16 39.88,10.16 39.88,15.24 38.35,15.24 38.35,16.64 35.94,16.64
  pour Top (no thermals): 19.56,0 38.48,0 38.48,11.43 35.56,11.43 35.56,14.1 41.91,14.1 41.91,19.94 33.02,19.94 33.02,13.72 27.56,13.72 27.56,17.4 19.56,17.4
SB  (via drill 0.35)
  Top 0.152: C9.1 54.83,21.59 57.71,21.59 U$2.PIN4
  Top 0.254: C9.1 54,22.41 v54,24.13
  Bottom 0.203: R11.1 34.29,31.75 35.31,32.77 TR1.3
  Bottom 0.254: v36.83,33.02 TR1.3 | v54,24.13 54.2,24.33 54.2,36.66 53.17,37.69 35.79,37.69 35.31,37.21 35.31,32.77
  other vias: 20.32,35.56 21.59,35.56 22.86,35.56 24.13,35.56 25.4,35.56 26.67,35.56 27.94,34.29 27.94,33.02 27.94,31.75 27.94,30.48 27.94,29.21 27.94,27.94 27.94,26.67 26.67,25.4 25.4,25.4 24.13,25.4 22.86,25.4 21.59,25.4 20.32,25.4 20.32,27.94 21.59,27.94 22.86,27.94 24.13,27.94 25.4,27.94 25.4,29.21 25.4,30.48 25.4,31.75 25.4,33.02 24.13,33.02 22.86,33.02 21.59,33.02 20.32,33.02 35.56,33.02 20.32,30.48 21.59,30.48 22.86,30.48 33.02,36.83 33.02,35.56 33.02,34.29 33.02,33.02 34.29,33.02 34.29,34.29 34.29,35.56 34.29,36.83 36.83,36.83 36.83,35.56 36.83,34.29 38.1,33.02 38.1,34.29 38.1,35.56 38.1,36.83 40.64,33.02 40.64,34.29 40.64,35.56 35.56,22.86 34.29,21.59 34.29,22.86 35.56,21.59 39.37,21.59 39.37,22.86 40.64,21.59 40.64,22.86 40.64,24.13
  pour Top (no thermals): 3.81,31.11 3.81,24.38 33.02,24.38 33.02,20.32 41.91,20.32 41.91,37.72 8,37.72 8,31.11
  pour Bottom (no thermals): 20.32,20.32 41.91,20.32 41.91,37.72 19.68,37.72 19.56,37.72 19.56,20.32
SENS_VCC  (via drill 0.35)
  Top 0.254: v39.12,10.96 39.32,10.76 39.32,2.71 40.81,1.22 55.07,1.22 v56.13,2.29
  Top 0.508: v62.23,1.27 62.99,0.51 71.12,0.51 72.18,1.57 CON2.P$4
  Bottom 0.254: U$3.P$8 38.82,12.06 C14.2 38.99,11.09 v39.12,10.96
  Bottom 0.508: IC1.5 63.73,7.3 C16.1 61.81,7.2 60.96,6.35 | 60.96,6.35 57.15,6.35 56.13,5.33 v56.13,2.29 | 60.96,6.35 60.96,3.81 62.23,2.54 v62.23,1.27
V5  (via drill 0.35)
  Top 0.152: IC_3.6 77.81,13.04 C6.1 | v62.23,27.94 63.01,28.72 R_I4.5 | R_I4.6 62.46,28.17 v62.23,27.94 | R_I4.7 62.5,27.67 v62.23,27.94 | R_I3.5 64.88,15.26 64.98,15.16 v65.41,15.16 65.42,15.18 R_I3.6
  Top 0.406: U$2.PIN20 64.69,18.28 C5.1 | v61.34,37.72 61.34,37.97 59.44,39.88 59.44,44.96 60.33,45.85 61.72,45.85 62.23,46.35 IC_2.4_A 62.23,47.88 62.48,48.13 64.26,48.13 64.77,47.62 IC_2.3_A
  Top 0.508: v67.31,19.05 v70.72,19.05
  Bottom 0.152: C5.1 65.41,17.57 v65.41,15.16
  Bottom 0.406: v61.34,37.72 63.5,35.56 68.58,35.56 69.85,34.29 69.85,20.32 70.72,19.45 v70.72,19.05 R_I1.6 R_I1.7 R_I1.8 75.56,13.55 C6.1
  Bottom 0.508: C5.1 66.46,18.2 v67.31,19.05
  other vias: 64.77,18.2 76.07,13.04
  pour Bottom (no thermals): 78.74,20.32 78.74,11.43 62.23,11.43 62.23,23.24 61.09,23.24 61.09,38.1 69.85,38.1 69.85,20.32
VCC
  cutout Bottom: 55.88,0 55.88,2.79 38.86,2.79 38.86,0
VDD  (via drill 0.35)
  Top 0.152: R8.2 63.92,10.92 57.66,10.92 56.3,12.28 C1.1
  Top 0.254: U$2.PIN1 55.51,23.48 54.26,24.74 53.75,24.74 53.4,24.38 53.4,24.31 48.13,19.05 v45.72,19.05
  Top 0.406: U$2.PIN13 56.87,15.68 56.59,15.4 56.59,12.99 C1.1 v55.88,12.7
  Bottom 0.203: C13.1 C12.1 C11.1 21.17,43.18 v20.32,43.18 v16.51,43.18 v15.24,43.18 v13.97,43.18 7.62,43.18 5.79,41.35 U$1.P$4
  Bottom 0.406: C13.1 46.14,44.45 55.32,44.45 55.32,13 55.63,12.7 v55.88,12.7
  other vias: 46.99,7.62 6.35,35.56 5.08,35.56 5.08,36.83 6.35,36.83 6.35,38.1 5.08,38.1 15.24,39.37 16.51,39.37 16.51,40.64 15.24,40.64 15.24,41.91 13.97,41.91 16.51,41.91 20.32,39.37 20.32,40.64 20.32,41.91 22.86,43.18 22.86,41.91 22.86,40.64 22.86,39.37 25.4,39.37 25.4,40.64 25.4,41.91 25.4,43.18 31.75,43.18 31.75,41.91 31.75,40.64 31.75,39.37 34.29,39.37 34.29,40.64 34.29,41.91 34.29,43.18 36.83,43.18 36.83,41.91 36.83,40.64 36.83,39.37 43.18,39.37 43.18,40.64 43.18,41.91 43.18,43.18 45.72,43.18 45.72,41.91 45.72,40.64 45.72,39.37 48.26,39.37 48.26,40.64 48.26,41.91 48.26,43.18 43.18,35.56 44.45,35.56 45.72,35.56 46.99,35.56 48.26,35.56 49.53,35.56 50.8,34.29 50.8,33.02 50.8,31.75 50.8,30.48 50.8,29.21 50.8,27.94 50.8,26.67 49.53,25.4 48.26,25.4 46.99,25.4 45.72,25.4 44.45,25.4 43.18,25.4 43.18,27.94 44.45,27.94 45.72,27.94 46.99,27.94 48.26,27.94 48.26,29.21 48.26,30.48 48.26,31.75 48.26,33.02 46.99,33.02 45.72,33.02 44.45,33.02 43.18,33.02 43.18,30.48 44.45,30.48 45.72,30.48 43.18,22.86 44.45,22.86 45.72,22.86 46.99,22.86 46.99,21.59 45.72,21.59 44.45,21.59 43.18,21.59 43.18,16.51 44.45,16.51 45.72,16.51 46.99,16.51 46.99,15.24 45.72,15.24 44.45,15.24 43.18,15.24 43.18,12.7 44.45,12.7 45.72,12.7 46.99,12.7 48.26,12.7 49.53,12.7 50.8,11.43 50.8,10.16 50.8,8.89 50.8,7.62 50.8,6.35 49.53,5.08 48.26,5.08 46.99,5.08 45.72,5.08 44.45,5.08 43.18,5.08 43.18,7.62 44.45,7.62 45.72,7.62 48.26,7.62 48.26,8.89 48.26,10.16 46.99,10.16 45.72,10.16 44.45,10.16 43.18,10.16
  pour Top (no thermals): 3.81,31.75 3.81,45.59 52.07,45.59 52.07,2.92 42.29,2.92 42.29,38.1 7.62,38.1 7.62,31.75
  pour Bottom (no thermals): 3.81,31.75 7.62,31.75 7.62,38.1 42.29,38.1 42.29,0 52.07,0 52.07,45.59 3.81,45.59
VDSTH  (via drill 0.35)
  Top 0.152: v64.52,23.5 64.52,23.48 U$2.PIN28 | v65.53,28.83 65.38,28.98 64.81,28.98 R_I4.4
  Bottom 0.152: v64.52,23.5 64.52,25.23 R6.1 64.35,25.87 65.53,27.05 v65.53,28.83
VIOUT  (via drill 0.35)
  Top 0.254: U$3.P$7 38.26,13.34 40.13,11.46 40.13,3.05 41.15,2.03 54.25,2.03 57.28,5.05 59.72,5.05 60.77,4 65.53,4 CON2.P$2
  other vias: 36.99,13.34

### Text on the board
tPlace: MotaDora | System | 0.hayate
bPlace: V_bat | GND